# EAGLE design shield (EAGLE 9.5.1)
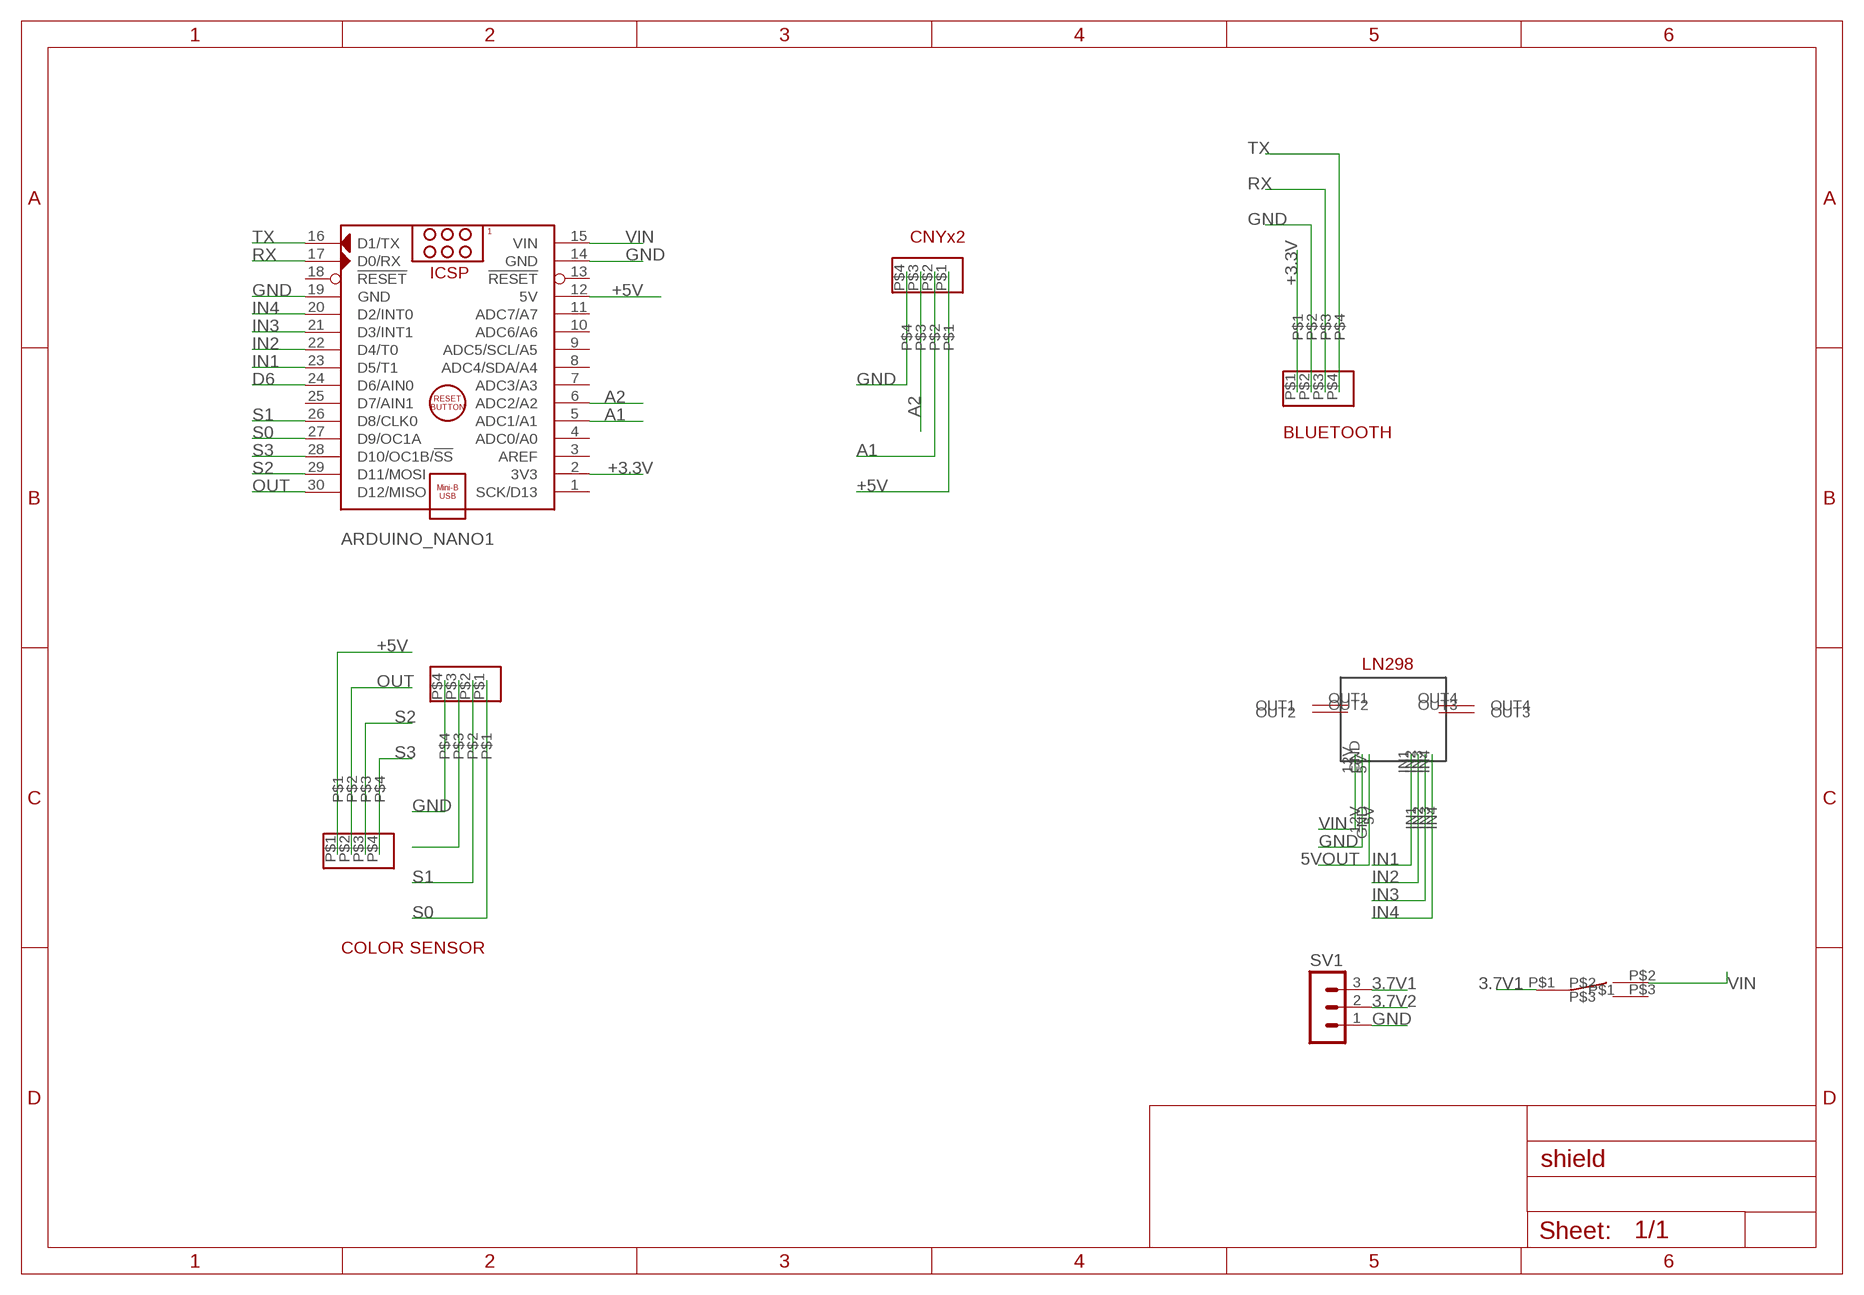
[diagram p0: schematic, sheet 1]

## Parts
ARDUINO_NANO1  ARDUINO_NANO  [ARDUINO_NANO]
SV1  MA03-1  [MA03-1]
U$1  PIN4  [PIN4]
U$2  PIN4  [PIN4]
U$3  INTERRUPTOR  [INTERRUPTOR]
U$4  PIN4  [PIN4]
U$5  LN298V2  [LN298V2]
U$6  PIN4  [PIN4]

## Nets
3.7V1: SV1.3 U$3.P$1
3.7V2: SV1.2
5VOUT: U$5.5V
+3.3V: ARDUINO_NANO1.2(3V3) U$1.P$1
+5V: ARDUINO_NANO1.12(5V) U$2.P$1 U$6.P$1
A1: ARDUINO_NANO1.5(ADC1/A1) U$6.P$2
A2: ARDUINO_NANO1.6(ADC2/A2) U$6.P$3
D6: ARDUINO_NANO1.24(D6/AIN0)
GND [gnd]: ARDUINO_NANO1.14(GND) ARDUINO_NANO1.19(GND) SV1.1 U$1.P$2 U$4.P$4 U$5.GND U$6.P$4
IN1: ARDUINO_NANO1.23(D5/T1) U$5.IN1
IN2: ARDUINO_NANO1.22(D4/T0) U$5.IN2
IN3: ARDUINO_NANO1.21(D3/INT1) U$5.IN3
IN4: ARDUINO_NANO1.20(D2/INT0) U$5.IN4
N$6: U$4.P$3
OUT: ARDUINO_NANO1.30(D12/MISO) U$2.P$2
RX: ARDUINO_NANO1.17(D0/RX) U$1.P$3
S0: ARDUINO_NANO1.27(D9/OC1A) U$4.P$1
S1: ARDUINO_NANO1.26(D8/CLK0) U$4.P$2
S2: ARDUINO_NANO1.29(D11/MOSI) U$2.P$3
S3: ARDUINO_NANO1.28(D10/OC1B/!SS) U$2.P$4
TX: ARDUINO_NANO1.16(D1/TX) U$1.P$4
VIN: ARDUINO_NANO1.15(VIN) U$3.P$2 U$5.12V
Unconnected: ARDUINO_NANO1.1(SCK/D13) ARDUINO_NANO1.3(AREF) ARDUINO_NANO1.4(ADC0/A0) ARDUINO_NANO1.7(ADC3/A3) ARDUINO_NANO1.8(ADC4/SDA/A4) ARDUINO_NANO1.9(ADC5/SCL/A5) ARDUINO_NANO1.10(ADC6/A6) ARDUINO_NANO1.11(ADC7/A7) ARDUINO_NANO1.13(!RESET) ARDUINO_NANO1.18(!RESET) ARDUINO_NANO1.25(D7/AIN1) U$3.P$3 U$5.OUT1 U$5.OUT2 U$5.OUT3 U$5.OUT4

## Notes on the sheet
- CNYx2
- BLUETOOTH
- COLOR SENSOR

## Library data of the parts
ARDUINO_NANO1 = ArduinoNanoV30:ARDUINO_NANO: Arduino Nano V3.0 Module Overview: The Arduino Nano is a small, complete, and breadboard-friendly board based on the ATmega328 (Arduino Nano 3.x) or ATmega168 (Arduino Nano 2.x). It has more or less the same functionality of the Arduino Duemilanove, but in a different package. It lacks only a DC power jack, and works with a Mini-B USB cable instead of a standard one. The Nano was designed and is being produced by Gravitech <http://www.gravitech.us/arna30wiatp.html>. General specifications: Item Value Microcontroller Atmel ATmega168 or ATmega328 Operating Voltage (logic level) 5 V Input Voltage (recommended) 7-12 V Input Voltage (limits) 6-20 V Digital I/O Pins 14 (of which 6 provide PWM output) Analog Input Pins 8 DC Current per I/O Pin 40 mA Flash Memory 16 KB (ATmega168) or 32 KB (ATmega328) of which 2 KB used by bootloader SRAM 1 KB (ATmega168) or 2 KB (ATmega328) EEPROM 512 bytes (ATmega168) or 1 KB (ATmega328) Clock Speed 16 MHz Dimensions (Inches) 0.73" x 1.70" Dimensions (mm) 18mm x 45mm Overall height About 9 mm (not including pins) Weigth 5 g Power: The Arduino Nano can be powered via the Mini-B USB connection, 6-20V unregulated external power supply (pin 30), or 5V regulated external power supply (pin 27). The power source is automatically selected to the highest voltage source. Memory: The ATmega168 has 16 KB of flash memory for storing code (of which 2 KB is used for the bootloader); the ATmega328 has 32 KB, (also with 2 KB used for the bootloader). The ATmega168 has 1 KB of SRAM and 512 bytes of EEPROM (which can be read and written with the EEPROM library); the ATmega328 has 2 KB of SRAM and 1 KB of EEPROM. Input and Output: Each of the 14 digital pins on the Nano can be used as an input or output, using pinMode(), digitalWrite(), and digitalRead() functions. They operate at 5 volts. Each pin can provide or receive a maximum of 40 mA and has an internal pull-up resistor (disconnected by default) of 20-50 kOhms. In addition, some pins have specialized functions. Visit Arduino - ArduinoBoardNano <https://www.arduino.cc/en/Main/ArduinoBoardNano>
SV1 = con-lstb:MA03-1: PIN HEADER; OC_FARNELL: unknown; OC_NEWARK: unknown
U$1 U$2 U$4 U$6 = PIN4:PIN4
U$3 = INTERRUPTOR:INTERRUPTOR
U$5 = ln298:LN298V2

## Net classes
2 gnd: width 0.254 mm, drill 0.61 mm, clearance 0.254 mm
3 usbvcc: width 0.254 mm, drill 0.61 mm, clearance 0.254 mm

## Board
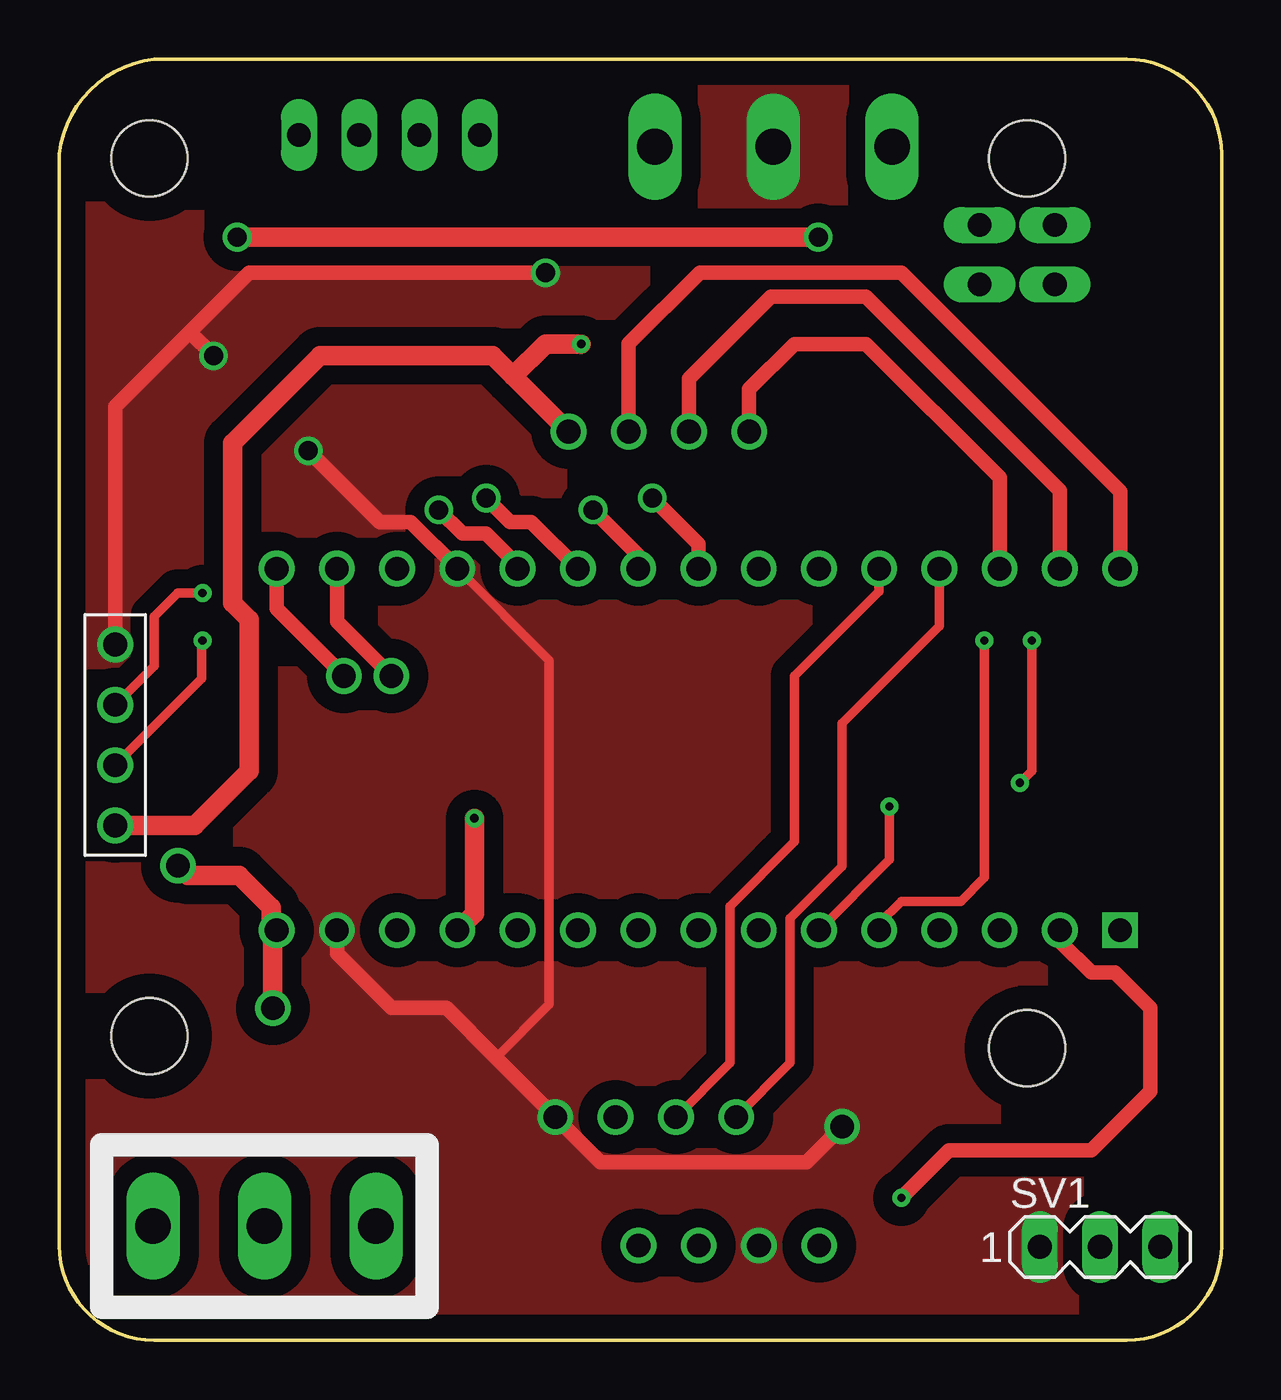
[diagram p1: board, top side]
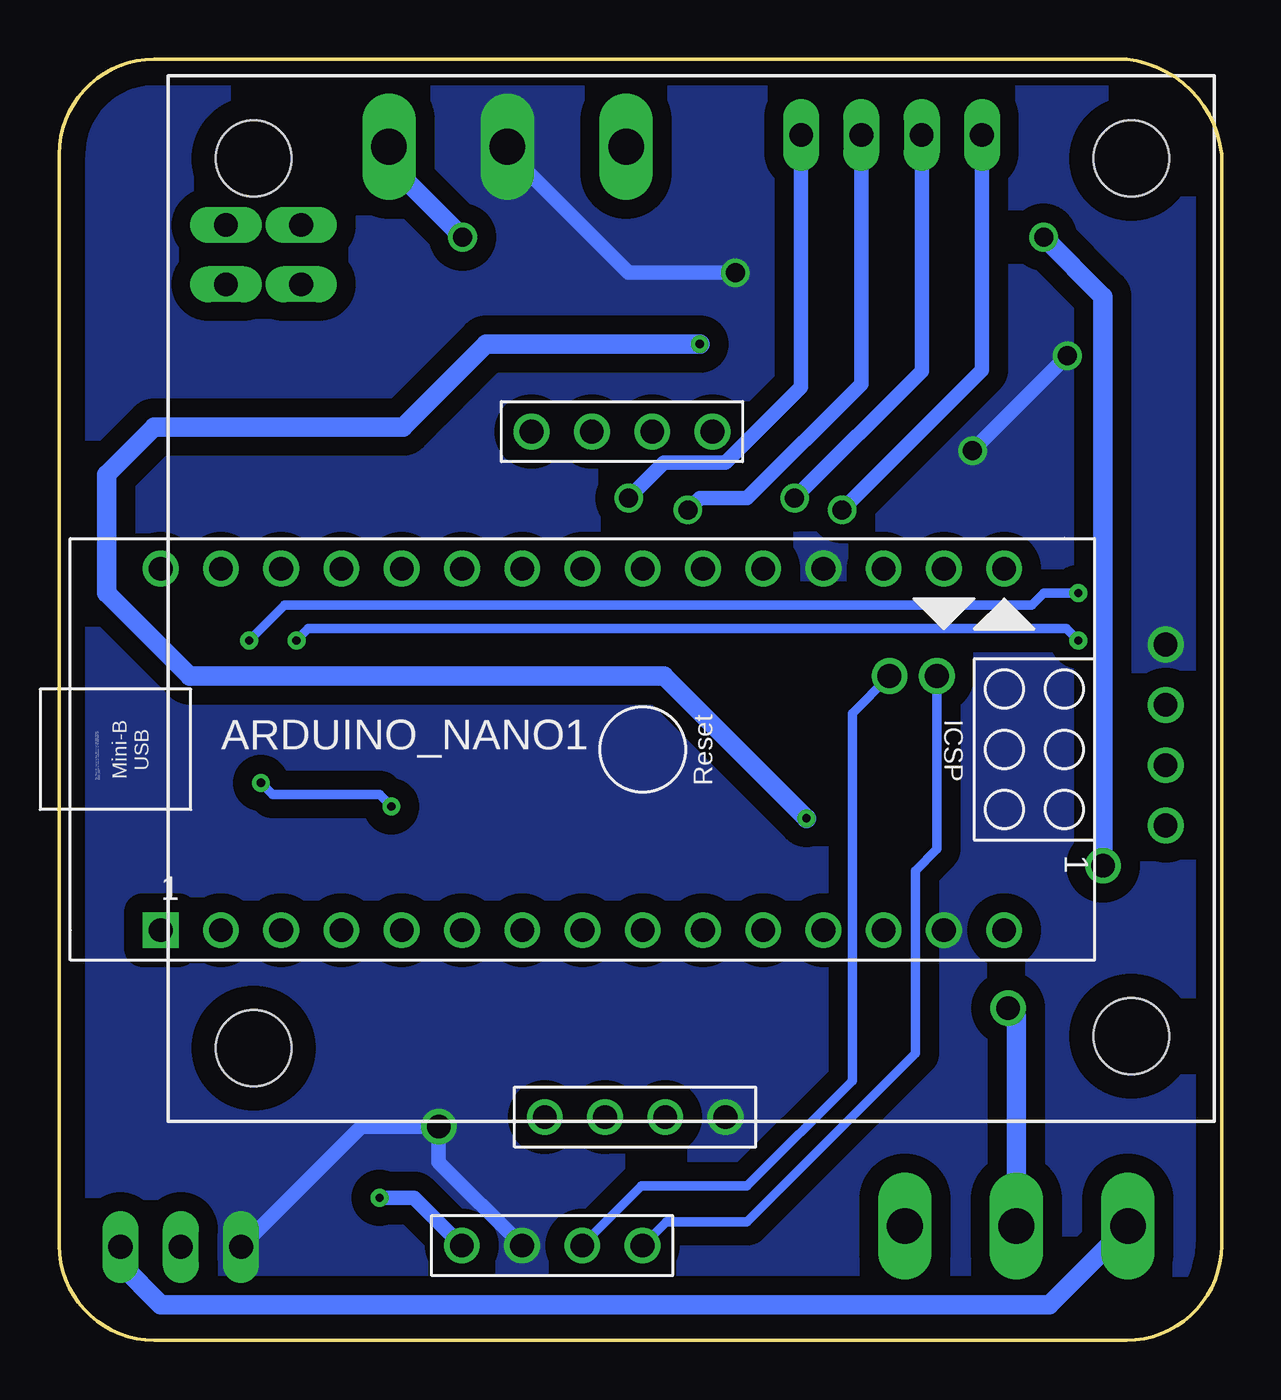
[diagram p2: board, bottom side, seen from below]

Size 49 x 54 mm. Coordinates in mm from the lower left corner, seen from the top.
Outline: 4,0 45,0 arc90 49,4 49,50 arc90 45,54 4,54 arc77 0,50 0,4 arc90 4,0
Copper layers (1*16): Top 0.035mm / dielectric 1.5mm / Bottom 0.035mm
Design rules "default *": minimum track width 6mil, minimum drill 0.35mm, track to track 10mil, track to pad 10mil, pad to pad 10mil, via to via 10mil, smd to smd 6mil, copper to edge 40mil, drill to drill 6mil, minimum pad ring 10mil, minimum via ring 8mil, stop-mask expansion 4mil, vias tented up to drill 0mil, thermal gap 10mil

### Footprints (pad centres in the part's own frame; a part is rotated, then mirrored left to right if it is on the bottom)
ARDUINO_NANO = drill 1 square: 1 -20.32,-7.62 | drill 1: 2 -17.78,-7.62; 3 -15.24,-7.62; 4 -12.7,-7.62; 5 -10.16,-7.62; 6 -7.62,-7.62; 7 -5.08,-7.62; 8 -2.54,-7.62; 9 0,-7.62; 10 2.54,-7.62; 11 5.08,-7.62; 12 7.62,-7.62; 13 10.16,-7.62; 14 12.7,-7.62; 15 15.24,-7.62; 16 15.24,7.62; 17 12.7,7.62; 18 10.16,7.62; 19 7.62,7.62; 20 5.08,7.62; 21 2.54,7.62; 22 0,7.62; 23 -2.54,7.62; 24 -5.08,7.62; 25 -7.62,7.62; 26 -10.16,7.62; 27 -12.7,7.62; 28 -15.24,7.62; 29 -17.78,7.62; 30 -20.32,7.62
MA03-1 = drill 1.016 long: 1 -2.54,0; 2 0,0; 3 2.54,0
PIN4 = drill 1: P$1 -3.81,0; P$2 -1.27,0; P$3 1.27,0; P$4 3.81,0
INTERRUPTOR = drill 1.5 pad 1.93 long: P$1 -4.7,0; P$2 0,0; P$3 4.7,0
LN298V2 = drill 1.5 long: 5V 24.8,3; 12V 34.8,3; GND 29.8,3 | drill 1 long: IN1 17.42,2.5; IN2 14.88,2.5; IN3 12.34,2.5; IN4 9.8,2.5; OUT1 41.67,8.8; OUT2 41.67,6.3; OUT3 38.5,6.3; OUT4 38.5,8.8 | hole 3.2: 3.5,3.5; 40.5,3.5; 40.5,41; 3.5,40.5

### Placement (x,y rotation side)
ARDUINO_NANO1  24.4,24.91 0 bottom
SV1  43.88,3.93 0 top
U$1  28.22,3.99 0 bottom
U$2  25.28,38.3 180 bottom
U$3  8.65,4.81 0 top
U$4  24.72,9.4 0 bottom
U$5  0.3,53.32 180 bottom
U$6  2.36,25.51 90 top

### Tracks (layer width: path | path; a pad name or v marks a point on that pad's centre or on a via)
3.7V1
  Bottom 0.813: U$3.P$1 7.26,1.5 44.72,1.5 46.42,3.2 SV1.3
+3.3V  (via drill 0.35)
  Top 0.61: v35.5,6 37.5,8 43.5,8 46,10.5 46,14 44.5,15.5 43.5,15.5 42.18,16.82 ARDUINO_NANO1.2
  Bottom 0.61: U$1.P$1 34.04,6 v35.5,6
+5V  (via drill 0.35)
  Top 0.813: U$2.P$1 19.13,40.63 | 19.13,40.63 18.27,41.5 11,41.5 7.31,37.81 7.31,31.07 8,30.38 8,24 5.7,21.7 U$6.P$1 | 19.13,40.63 20.5,42 v22,42 | v17.5,22 17.5,18 ARDUINO_NANO1.12
  Bottom 0.813: v22,42 31,42 34.5,38.5 45,38.5 47,36.5 47,31.5 43.5,28 23.5,28 v17.5,22
A1  (via drill 0.35)
  Top 0.406: U$6.P$2 6,27.89 6,29.5 v6.04,29.5 | v39,29.5 39,19.5 38,18.5 35.5,18.5 34.56,17.56 ARDUINO_NANO1.5
  Bottom 0.406: v6.04,29.5 6.54,30 38.5,30 v39,29.5
A2  (via drill 0.35)
  Top 0.406: U$6.P$3 4,28.43 4,30.5 5,31.5 v6.04,31.5 | v41,29.5 41,24 v40.5,23.5 | v35,22.5 35,20.26 ARDUINO_NANO1.6
  Bottom 0.406: v6.04,31.5 7.5,31.5 8,31 39.5,31 v41,29.5 | v40.5,23.5 40,23 35.5,23 v35,22.5
GND  (via drill 0.8, 1)
  Top 0.406: ARDUINO_NANO1.19 20.65,28.66 20.65,14.15 18.41,11.91
  Top 0.61: ARDUINO_NANO1.14 11.7,16.3 14,14 16.32,14 18.41,11.91 U$4.P$4 22.82,7.5 31.5,7.5 v33,9 | U$6.P$4 2.36,39.36 5.5,42.5 | 5.5,42.5 8,45 v20.5,45 | 5.5,42.5 v6.5,41.5 | v10.5,37.5 13.5,34.5 14.81,34.5 ARDUINO_NANO1.19
  Bottom 0.61: SV1.1 36.27,9 v33,9 33,7.5 U$1.P$2 | v20.5,45 25,45 30.1,50.1 U$5.GND | v6.5,41.5 v10.5,37.5
  pour Top (isolate 0.8, no thermals): 0,53.5 49.11,53.5 49.11,0.08 0,0.08
  pour Bottom (isolate 0.8, no thermals): 0,53.5 49,53.5 49,0 0,0
IN1  (via drill 0.8)
  Top 0.61: v25,35.5 26.94,33.56 ARDUINO_NANO1.23
  Bottom 0.61: v25,35.5 23.51,36.99 20.92,36.99 17.72,40.19 U$5.IN1
IN2  (via drill 0.8)
  Top 0.61: v22.5,35 24.4,33.1 ARDUINO_NANO1.22
  Bottom 0.61: U$5.IN2 15.18,40.32 20,35.5 22,35.5 v22.5,35
IN3  (via drill 0.8)
  Top 0.61: v18,35.5 19,34.5 19.89,34.5 ARDUINO_NANO1.21
  Bottom 0.61: U$5.IN3 12.64,40.86 v18,35.5
IN4  (via drill 0.8)
  Top 0.61: v16,35 17,34 18,34 19.32,32.68 ARDUINO_NANO1.20
  Bottom 0.61: U$5.IN4 10.1,40.9 v16,35
OUT
  Top 0.61: U$2.P$2 24.01,42.01 27,45 35.5,45 44.72,35.78 ARDUINO_NANO1.30
RX  (via drill 1)
  Top 0.61: v14,28 11.7,30.3 ARDUINO_NANO1.17
  Bottom 0.406: v14,28 15.57,26.43 15.57,10.93 20,6.5 24.45,6.5 U$1.P$3
S0
  Top 0.406: ARDUINO_NANO1.27 37.1,30.1 33,26 33,19.98 30.81,17.79 30.81,11.68 U$4.P$1
S1
  Top 0.406: ARDUINO_NANO1.26 34.56,31.56 31,28 31,21.02 28.27,18.29 28.27,11.68 U$4.P$2
S2
  Top 0.61: U$2.P$3 26.55,40.55 30,44 34,44 42.18,35.82 ARDUINO_NANO1.29
S3
  Top 0.61: U$2.P$4 29.09,40.09 31,42 34,42 39.64,36.36 ARDUINO_NANO1.28
TX  (via drill 1)
  Top 0.61: v12,28 9.16,30.84 ARDUINO_NANO1.16
  Bottom 0.406: v12,28 12,20.7 12.92,19.79 12.92,12.08 20,5 23.41,5 U$1.P$4
VIN  (via drill 0.8, 1)
  Top 0.813: v5,20 5.4,19.6 7.58,19.6 8.94,18.24 8.94,17.52 ARDUINO_NANO1.15 9,17.12 v9,14 | v7.5,46.5 v32,46.5
  Bottom 0.813: v5,20 5,44 v7.5,46.5 | v9,14 8.65,13.65 U$3.P$2 | v32,46.5 35.1,49.6 U$5.12V